# EasyEDA Pro project gps-v1.0.eprj

# Schematic Schematic1
Board Name: Board1; Create Date: 2025-04-23; Page Name: P1; Project Name: gps-v1.0; Schematic Name: Schematic1; Update Date: 2025-04-29; Company: EasyEDA.com; Page Size: A4; Version: V1.0
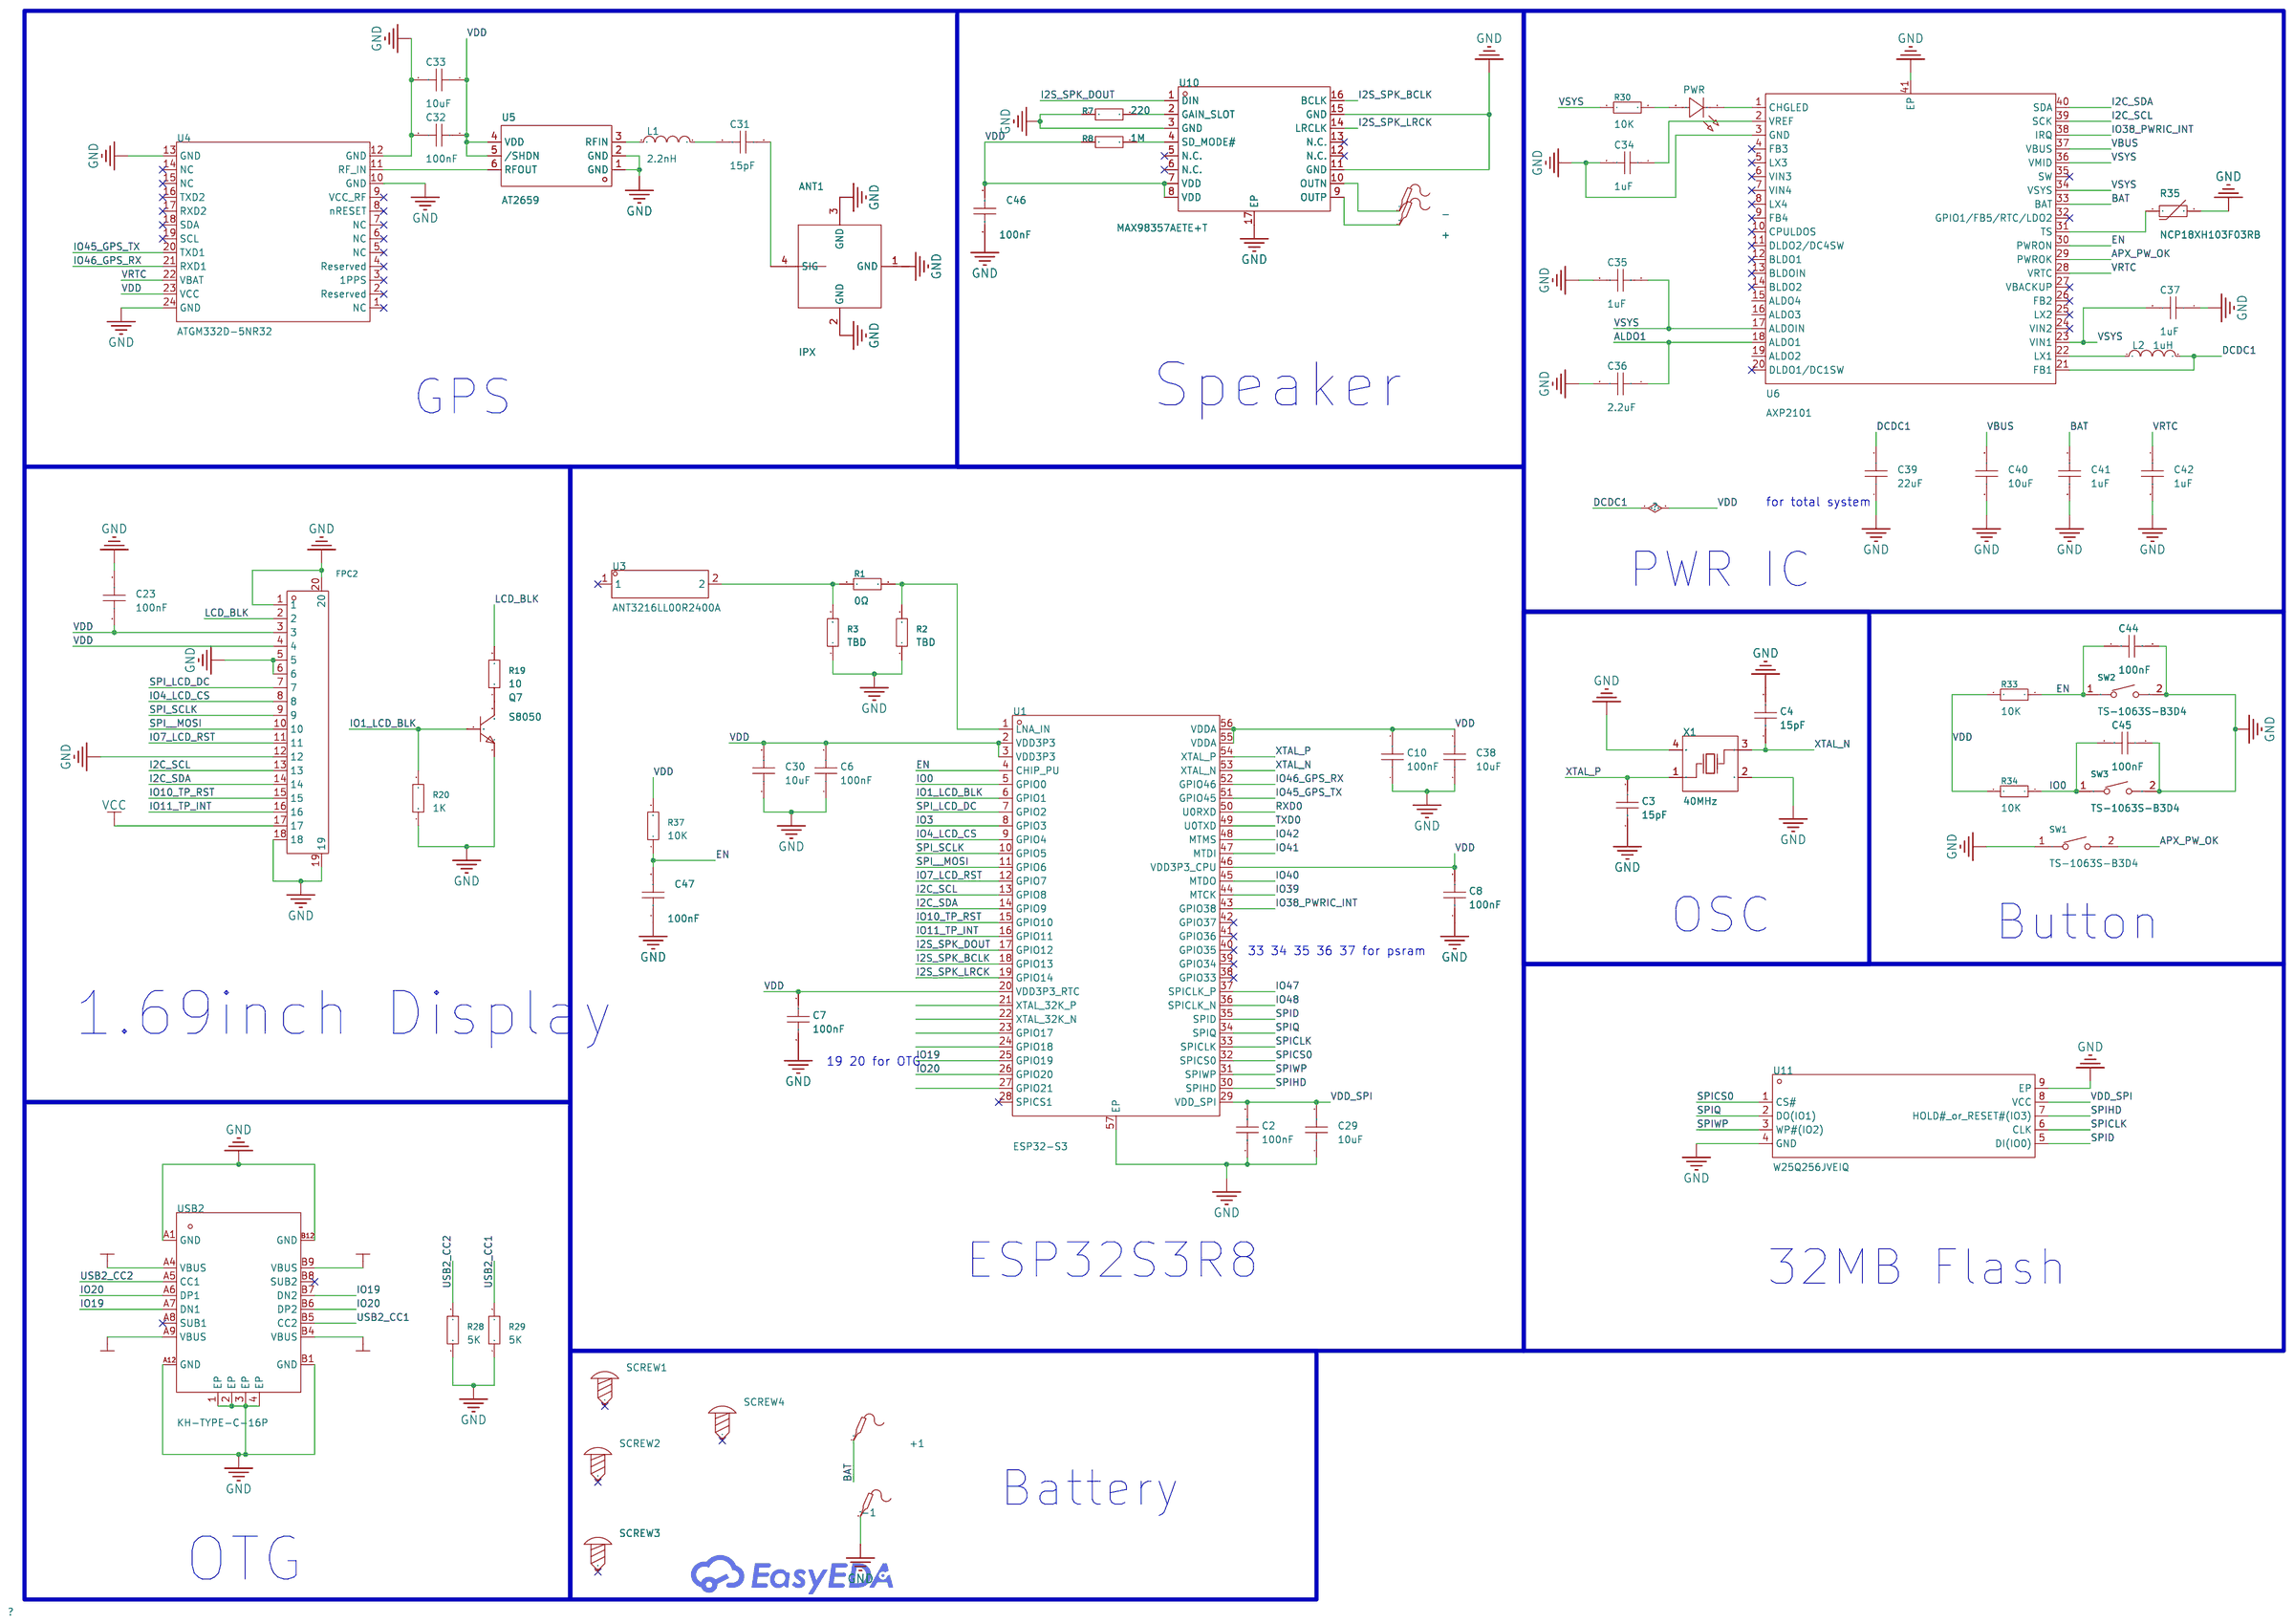
[diagram p0: schematic sheet]

## Parts
+  -  [Test-Point-0.5mm]
+1  -  [Test-Point-0.5mm]
-  -  [Test-Point-0.5mm]
-1  -  [Test-Point-0.5mm]
ANT1  IPX  [ANT-SMD_KH-IPEX-K501-29]
C2  100nF  [C0402]
C3  15pF  [C0402]
C4  15pF  [C0402]
C6  100nF  [C0402]
C7  100nF  [C0402]
C8  100nF  [C0402]
C10  100nF  [C0402]
C23  100nF  [C0402]
C29  10uF  [C0603]
C30  10uF  [C0603]
C31  15pF  [C0402]
C32  100nF  [C0402]
C33  10uF  [C0603]
C34  1uF  [C0402]
C35  1uF  [C0402]
C36  2.2uF  [C0402]
C37  1uF  [C0402]
C38  10uF  [C0603]
C39  22uF  [C0603]
C40  10uF  [C0603]
C41  1uF  [C0402]
C42  1uF  [C0402]
C44  100nF  [C0402]
C45  100nF  [C0402]
C46  100nF  [C0402]
C47  100nF  [C0402]
FPC2  FPC-05F-18PH20  [FPC-SMD_18P-P0.50_FPC-05F-18PH20]
L1  2.2nH  [L0603]
L2  1uH  [L0603]
PWR  XL-1608SURC-06  [LED0603-RD_RED]
Q7  S8050  [SOT-23-3_L2.9-W1.3-P1.90-LS2.3-BR]
R1  0Ω  [R0402]
R2  TBD  [R0402]
R3  TBD  [R0402]
R7  220  [R0402]
R8  1M  [R0402]
R19  10  [R0402]
R20  1K  [R0402]
R28  5K  [R0402]
R29  5K  [R0402]
R30  10K  [R0402]
R33  10K  [R0402]
R34  10K  [R0402]
R35  NCP18XH103F03RB  [R0603]
R37  10K  [R0402]
SCREW1  -  [Screw-Hole-M2]
SCREW2  -  [Screw-Hole-M2]
SCREW3  -  [Screw-Hole-M2]
SCREW4  -  [Screw-Hole-M2]
SW1  TS-1063S-B3D4  [KEY-SMD_L3.0-W2.5-LS4.0_TS-1603S]
SW2  TS-1063S-B3D4  [KEY-SMD_L3.0-W2.5-LS4.0_TS-1603S]
SW3  TS-1063S-B3D4  [KEY-SMD_L3.0-W2.5-LS4.0_TS-1603S]
U1  ESP32-S3  [QFN-56_L7.0-W7.0-P0.40-TL-EP4.0]
U3  ANT3216LL00R2400A  [ANT-SMD_L3.2-W1.6]
U4  ATGM332D-5NR32  [GSM-SMD_ATGM332D-5N11]
U5  AT2659  [DFN-6_L1.6-W1.0-P0.55-BL]
U6  AXP2101  [QFN-40_L5.0-W5.0-P0.40-TL-EP3.4]
U10  MAX98357AETE+T  [TQFN-16_L3.0-W3.0-P0.50-BL-EP1.5]
U11  W25Q256JVEIQ  [WSON-8_L8.0-W6.10-P1.27-BL-EP]
USB2  KH-TYPE-C-16P  [USB-C-SMD_KH-TYPE-C-16P]
X1  40MHz  [OSC-SMD_4P-L3.2-W2.5-BL_SIT8008BI]

## Library data of the parts
+ +1 - -1 = Test-Point
ANT1 = IPX: Supplier Part: C9900014785; Supplier Footprint: GSM_ANT; JLCPCB Part Class: Extended Part; Supplier: LCSC
C2-C4 C6-C8 C10 C31 C32 C34-C37 C41 C42 C44 C45 = CL05A105KA5NQNC: Capacitance: Tolerance:±10% Tolerance:±10% Voltage Rated: Temperature Coefficient:; LCSC Part Name: 1uF ±10% 25V; Supplier Part: C52923; Manufacturer: SAMSUNG(三星); Supplier Footprint: 0402; JLCPCB Part Class: Basic Part; Datasheet: https://atta.szlcsc.com/upload/public/pdf/source/20160218/1457707763339.pdf; Supplier: LCSC; Tolerance: ±10%
C23 C46 C47 = CL05B104KO5NNNC: Capacitance: Tolerance:±10% Tolerance:±10% Voltage Rated: Temperature Coefficient:; LCSC Part Name: 100nF ±10% 16V; Supplier Part: C1525; Manufacturer: SAMSUNG(三星); Supplier Footprint: 0402; JLCPCB Part Class: Basic Part; Datasheet: https://atta.szlcsc.com/upload/public/pdf/source/20160218/1457707763339.pdf; Supplier: LCSC; Tolerance: ±10%
C29 C30 C33 C38-C40 = CGA0603X5R106K100JT: Capacitance:10uF Tolerance:±10% Tolerance:±10% Voltage Rating:10V Temperature Coefficient:X5R; LCSC Part Name: 10uF ±10% 10V; Supplier Part: C6119842; Manufacturer: HRE(芯声); Supplier Footprint: 0603; JLCPCB Part Class: Extended Part; Supplier: LCSC; Tolerance: ±10%; Voltage Rating: 10V; Temperature Coefficient: X5R
FPC2 = FPC-05F-18PH20: Locking Feature:Clamshell Contact Type:Bottom Contact Number of Contacts:18P Pitch:0.5mm Mounting Type:卧贴 FFC, FCB Thickness:0.3mm FFC, FCB Thickness:0.3mm Height Above Board:2mm Operating Temperature Range:-25℃~+85℃ Operating Temperature Range:-25℃~+85℃; LCSC Part Name: 间距:0.5mm P数:18P 翻盖式 下接; Supplier Part: C2856802; Manufacturer: XUNPU(讯普); Supplier Footprint: SMD,P=0.5mm,卧贴; JLCPCB Part Class: Extended Part; Datasheet: https://atta.szlcsc.com/upload/public/pdf/source/20210922/C2856802_2A845D1961F33AEC1ED22CECB292335F.pdf; Supplier: LCSC; Locking Feature: Clamshell; Contact Type: Bottom Contact; Number of Contacts: 18P; Pitch: 0.5mm; Mounting Type: 卧贴; FFC, FCB Thickness: 0.3mm; Height Above Board: 2mm; Operating Temperature Range: -25℃~+85℃
L1 L2 = LQM18FN100M00D: LCSC Part Name: 10uH ±20% 50mA 停产; Supplier Part: C86083; Manufacturer: muRata(村田); Supplier Footprint: 0603; JLCPCB Part Class: Extended Part; Datasheet: https://atta.szlcsc.com/upload/public/pdf/source/20181211/C324471_E5AB673E56FAD8B75EB4C57DC23E4148.pdf; Supplier: LCSC; Tolerance: ±20%; Current Rating: 50mA; Current - Saturation (Isat): 50mA; DC Resistance(DCR): 1.17Ω; Frequency - Self Resonant: 30MHz
PWR = XL-1608SURC-06: Lamp Holder Type:- Illumination Color:Red Voltage - Forward(Vf):2.3V Voltage - Forward(Vf):2.3V Power(Watts):50mW Forward Current:20mA Wavelength - Dominant:620nm~630nm Wavelength - Dominant:620nm~630nm Peak Wavelength:625nm Diode Configuration:- Lens Col; Supplier Part: C965799; Manufacturer: XINGLIGHT(成兴光); Supplier Footprint: 0603; JLCPCB Part Class: Extended Part; Datasheet: https://atta.szlcsc.com/upload/public/pdf/source/20250213/F9766CE804AF391355DCDD48DB3E0DAB.pdf; Supplier: LCSC; Illumination Color: Red; Voltage - Forward(Vf): 2.3V; Power(Watts): 50mW; Forward Current: 20mA; Wavelength - Dominant: 620nm~630nm; Peak Wavelength: 625nm; Lens Color: Colorless Transparent Lens; Luminous Intensity: 225mcd; Viewing Angle: 120°; Mounting Sytle: Positive Stick; Operating Temperature: -20℃~+85℃
Q7 = S8050_C20069125: type:NPN Current - Collector(Ic): Collector - Emitter Voltage VCEO: Pd - Power Dissipation:300mW DC Current Gain:120@50mA,1.0V DC Current Gain:120@50mA,1.0V Transition frequency(fT):100MHz Current - Collector Cutoff:100nA Vce Saturation(VCE(sat)):600mV Op; LCSC Part Name: hFE:200-350，丝印:J3Y S8050; Supplier Part: C20069125; Manufacturer: 宏嘉诚; Supplier Footprint: SOT-23; JLCPCB Part Class: Extended Part; Datasheet: https://atta.szlcsc.com/upload/public/pdf/source/20250107/343E8B94B5C24D0D65D7D4B70E0B73F6.pdf; Supplier: LCSC; type: NPN; Pd - Power Dissipation: 300mW; DC Current Gain: 120@50mA,1.0V; Transition frequency(fT): 100MHz; Current - Collector Cutoff: 100nA; Vce Saturation(VCE(sat)): 600mV; Operating Temperature: -55℃~+150℃
R1-R3 R30 = 0402WGF0000TCE: Type:Thick Film Resistors Resistance: Tolerance:±1% Tolerance:±1% Power(Watts): Overload Voltage (Max): Temperature Coefficient:±800ppm/℃ Temperature Coefficient:±800ppm/℃ Operating Temperature Range:-55℃~+155℃ Operating Temperature Range:-55℃~+155℃; LCSC Part Name: 0Ω ±1% 62.5mW 厚膜电阻; Supplier Part: C17168; Manufacturer: UNI-ROYAL(厚声); Supplier Footprint: 0402; JLCPCB Part Class: Basic Part; Datasheet: https://atta.szlcsc.com/upload/public/pdf/source/20200306/C422600_1E6D84923E4A46A82E41ADD87F860B5C.pdf; Supplier: LCSC; Type: Thick Film Resistors; Tolerance: ±1%; Temperature Coefficient: ±800ppm/℃; Operating Temperature Range: -55℃~+155℃
R7 R8 R19 R20 R28 R29 R33 R34 R37 = 0402WGF4700TCE: Type:Thick Film Resistors Resistance: Tolerance:±1% Tolerance:±1% Power(Watts): Overload Voltage (Max): Temperature Coefficient:±100ppm/℃ Temperature Coefficient:±100ppm/℃ Operating Temperature Range:-55℃~+155℃ Operating Temperature Range:-55℃~+155℃; LCSC Part Name: 470Ω ±1% 62.5mW 厚膜电阻; Supplier Part: C25117; Manufacturer: UNI-ROYAL(厚声); Supplier Footprint: 0402; JLCPCB Part Class: Basic Part; Datasheet: https://atta.szlcsc.com/upload/public/pdf/source/20200306/C422600_1E6D84923E4A46A82E41ADD87F860B5C.pdf; Supplier: LCSC; Type: Thick Film Resistors; Tolerance: ±1%; Temperature Coefficient: ±100ppm/℃; Operating Temperature Range: -55℃~+155℃
R35 = NCP18XH103F03RB: LCSC Part Name: 10kΩ 电阻精度:±1% 3380K; Supplier Part: C13564; Manufacturer: muRata(村田); Supplier Footprint: 0603; Datasheet: https://atta.szlcsc.com/upload/public/pdf/source/20130819/1457706638081.pdf; Supplier: LCSC; B Constant (25℃/85℃): 3434K; B Constant (25℃/100℃): 3455K; Steady State Current (Max): 310uA; Operating Temperature: -40℃~+125℃
SCREW1-SCREW4 = Screw-Hole-M2: Supplier Footprint: 插件
SW1-SW3 = TS-1063S-B3D4: LCSC Part Name: 轻触开关3.0*2.5侧按贴片带柱小小龟250gf; Supplier Part: C498291; Manufacturer: Yuandi(元迪); JLCPCB Part Class: Extended Part; Datasheet: https://atta.szlcsc.com/upload/public/pdf/source/20200318/C498291_A3607BD92317BA61A63F6AFAF35A0DD0.pdf; Supplier: LCSC; Circuit: SPST; Actuator Style: Rectangle button; Operating Force: 250gf
U1 = ESP32-S3: Frequency Range:2412MHz~2484MHz Frequency Range:2412MHz~2484MHz Interface:ADC,GPIO,I2C,I2S,PWM,SPI,UART,USB Operating Voltage:3V~3.6V Operating Voltage:3V~3.6V Applications:WiFi；IoT Output Power:21dBm Data Rate:150Mbps Current Of Transmitting:340mA Sensit; LCSC Part Name: 支持2.4GHz WIFI和低功耗蓝牙的MCU SoC; Supplier Part: C2913192; Manufacturer: ESPRESSIF(乐鑫); Supplier Footprint: QFN-56-EP(7x7); JLCPCB Part Class: Extended Part; Datasheet: https://atta.szlcsc.com/upload/public/pdf/source/20241030/3428D9BCA56E860957850BFAF37EAC62.pdf; Supplier: LCSC; Frequency Range: 2412MHz~2484MHz; Interface: ADC,GPIO,I2C,I2S,PWM,SPI,UART,USB; Operating Voltage: 3V~3.6V; Applications: WiFi；IoT; Output Power: 21dBm; Data Rate: 150Mbps; Current Of Transmitting: 340mA; Sensitivity: -98.4dBm; Receive Current: 88mA; Typical Application Frequency: 2.4GHz; Operating Temperature: -40℃~+105℃
U3 = ANT3216LL00R2400A: Antenna Type:Chip Antenna Central Frequency:2450MHz Bandwidth:160MHz Peak Gain:5.05dBi Peak Gain:5.05dBi Polarization Type:Linear Impedance:50Ω Power capacity:1W VSWR:- Operating Temperature:-40℃~+105℃ Operating Temperature:-40℃~+105℃; LCSC Part Name: 无线组件陶瓷芯片天线; Supplier Part: C293767; Manufacturer: YAGEO(国巨); Supplier Footprint: 1206; JLCPCB Part Class: Extended Part; Datasheet: https://atta.szlcsc.com/upload/public/pdf/source/20181012/C293767_CDE82A2F74DC82A94DB708CB53B68F23.pdf; Supplier: LCSC; Antenna Type: Chip Antenna; Central Frequency: 2450MHz; Bandwidth: 160MHz; Peak Gain: 5.05dBi; Polarization Type: Linear; Impedance: 50Ω; Power capacity: 1W; Operating Temperature: -40℃~+105℃
U4 = ATGM332D-5NR32: LCSC Part Name: BDS/GNSS 全星座定位导航模块; Supplier Part: C3037611; Manufacturer: 杭州中科微; JLCPCB Part Class: Extended Part; Datasheet: https://atta.szlcsc.com/upload/public/pdf/source/20220623/89B350A4689FD8DAA801C638D9ED4BB8.pdf; Supplier: LCSC
U5 = AT2659: LCSC Part Name: L1频段卫星导航射频前端低噪声放大器芯片; Supplier Part: C92450; Manufacturer: 杭州中科微; Supplier Footprint: DFN-6(1x1.6); JLCPCB Part Class: Extended Part; Datasheet: https://atta.szlcsc.com/upload/public/pdf/source/20170105/1483610792788.pdf; Supplier: LCSC; Supply Voltage: 1.4V~3.6V; Gain: 21.5dB; P1dB: -14dBm; Noise Figure: 0.8dB
U6 = AXP2101: Supplier Part: C3036461; Manufacturer: x-powers; Supplier Footprint: QFN-40-EP(5x5); JLCPCB Part Class: Extended Part; Datasheet: https://atta.szlcsc.com/upload/public/pdf/source/20230506/27D868F447993329A9E953603DF31964.pdf; Supplier: LCSC
U10 = MAX98357AETE+T: Type of Power Amplifier: Speaker Channels:Monaural Output Power: Supply Voltage:2.5V~5.5V Supply Voltage:2.5V~5.5V Operating Temperature:-40℃~+85℃ Operating Temperature:-40℃~+85℃; LCSC Part Name: 微型、低成本、PCM 类 D 级放大器具有 AB 级性能; Supplier Part: C910544; Manufacturer: ADI(亚德诺)/MAXIM(美信); Supplier Footprint: TQFN-16-EP(3x3); JLCPCB Part Class: Extended Part; Datasheet: https://atta.szlcsc.com/upload/public/pdf/source/20210106/C910544_CB6DE4B2CEE254A72E6BDB40E718D281.pdf; Supplier: LCSC; Speaker Channels: Monaural; Supply Voltage: 2.5V~5.5V; Operating Temperature: -40℃~+85℃
U11 = W25Q256JVEIQ_C97522: Supplier Part: C97522; Manufacturer: WINBOND(华邦); Supplier Footprint: WSON-8-EP(6x8); JLCPCB Part Class: Extended Part; Datasheet: https://atta.szlcsc.com/upload/public/pdf/source/20190529/C97522_47AE152D0BB11FB4C8509E398C0AD2EA.pdf; Supplier: LCSC; Interface Type: SPI; Memory Size: 256Mbit; Clock Frequency (fc): 133MHz; Supply Voltage: 2.7V~3.6V; Page Programming Time (Tpp): 700us; Block Erase Time (tBE): 120ms@(32KB); Data Retention - TDR (Year): 20 years; Operating Temperature: -40℃~+85℃
USB2 = KH-TYPE-C-16P: Connector Type:Type-C Standard:- Gender:Female Number of Ports:1 Number of Contacts:16P Mounting Style:卧贴 Current Rating - Power (Max):3A Operating Temperature Range:-40℃~+85℃ Operating Temperature Range:-40℃~+85℃; LCSC Part Name: Type-C 母 卧贴; Supplier Part: C709357; Manufacturer: kinghelm(金航标); Supplier Footprint: SMD; JLCPCB Part Class: Extended Part; Datasheet: https://atta.szlcsc.com/upload/public/pdf/source/20200911/C709357_AA8DCEB38BB20E3035A7ED7AE7667837.pdf; Supplier: LCSC; Connector Type: Type-C; Gender: Female; Number of Ports: 1; Number of Contacts: 16P; Mounting Style: 卧贴; Current Rating - Power (Max): 3A; Operating Temperature Range: -40℃~+85℃
X1 = X322540MPB4SI: Crystal Type:Surface Mount Crystal Frequency: Normal temperature Frequency Tolerance:±10ppm Normal temperature Frequency Tolerance:±10ppm External load capacitor: Frequency Stability(Full temperature range):±20ppm Frequency Stability(Full temperature rang; LCSC Part Name: 40MHz ±10ppm 15pF; Supplier Part: C9010; Manufacturer: YXC(扬兴晶振); Supplier Footprint: SMD3225-4P; JLCPCB Part Class: Extended Part; Datasheet: https://atta.szlcsc.com/upload/public/pdf/source/20240329/19D5F850207469550BEB00D7DFEDBC7A.pdf; Supplier: LCSC; Crystal Type: Surface Mount Crystal; Normal temperature Frequency Tolerance: ±10ppm; Frequency Stability(Full temperature range): ±20ppm

## Nets
GND: -1.1 ANT1.1(GND) ANT1.2(GND) ANT1.3(GND) C2.1 C3.1 C4.2 C6.1 C7.1 C8.1 C10.1 C23.1 C29.1 C30.1 C32.2 C33.2 C34.2 C35.2 C36.2 C37.1 C38.1 C39.1 C40.1 C41.2 C42.2 C44.2 C45.1 C46.1 C47.1 FPC2.1 FPC2.5 FPC2.6 FPC2.12 FPC2.18 FPC2.19 FPC2.20 Q7.2(E) R2.1 R3.1 R7.2 R20.1 R28.1 R29.1 R35.2 SW1.1 SW2.2 SW3.2 U1.57(EP) U4.10(GND) U4.12(GND) U4.13(GND) U4.24(GND) U5.1(GND) U5.2(GND) U6.3(GND) U6.41(EP) U10.3(GND) U10.11(GND) U10.15(GND) U10.17(EP) U11.4(GND) U11.9(EP) USB2.1(EP) USB2.2(EP) USB2.3(EP) USB2.4(EP) USB2.A1(GND) USB2.A12(GND) USB2.B1(GND) USB2.B12(GND) X1.2(GND) X1.4(GND)
VBUS: C40.2 U6.37(VBUS) USB2.A4(VBUS) USB2.A9(VBUS) USB2.B4(VBUS) USB2.B9(VBUS)
VCC: FPC2.17
VDD_SPI: C2.2 C29.2 U1.29(VDD_SPI) U11.8(VCC)
ALDO1: C36.1 U6.18(ALDO1)
APX_PW_OK: SW1.2 U6.29(PWROK)
BAT: +1.1 C41.1 U6.33(BAT)
DCDC1: C6.2 C7.2 C8.2 C10.2 C23.2 C30.2 C32.1 C33.1 C38.2 C39.2 C46.2 FPC2.3 FPC2.4 L2.2 R8.2 R33.2 R34.2 R37.2 U1.2(VDD3P3) U1.3(VDD3P3) U1.20(VDD3P3_RTC) U1.46(VDD3P3_CPU) U1.55(VDDA) U1.56(VDDA) U4.23(VCC) U5.4(VDD) U5.5(/SHDN) U6.21(FB1) U10.7(VDD) U10.8(VDD)
EN: C44.1 C47.2 R33.1 R37.1 SW2.1 U1.4(CHIP_PU) U6.30(PWRON)
I2C_SCL: FPC2.13 U1.13(GPIO8) U6.39(SCK)
I2C_SDA: FPC2.14 U1.14(GPIO9) U6.40(SDA)
I2S_SPK_BCLK: U1.18(GPIO13) U10.16(BCLK)
I2S_SPK_DOUT: U1.17(GPIO12) U10.1(DIN)
I2S_SPK_LRCK: U1.19(GPIO14) U10.14(LRCLK)
IO0: C45.2 R34.1 SW3.1 U1.5(GPIO0)
IO1_LCD_BLK: Q7.1(B) R20.2 U1.6(GPIO1)
IO3: U1.8(GPIO3)
IO4_LCD_CS: FPC2.8 U1.9(GPIO4)
IO7_LCD_RST: FPC2.11 U1.12(GPIO7)
IO10_TP_RST: FPC2.15 U1.15(GPIO10)
IO11_TP_INT: FPC2.16 U1.16(GPIO11)
IO19: U1.25(GPIO19) USB2.A7(DN1) USB2.B7(DN2)
IO20: U1.26(GPIO20) USB2.A6(DP1) USB2.B6(DP2)
IO38_PWRIC_INT: U1.43(GPIO38) U6.38(IRQ)
IO39: U1.44(MTCK)
IO40: U1.45(MTDO)
IO41: U1.47(MTDI)
IO42: U1.48(MTMS)
IO45_GPS_TX: U1.51(GPIO45) U4.20(TXD1)
IO46_GPS_RX: U1.52(GPIO46) U4.21(RXD1)
IO47: U1.37(SPICLK_P)
IO48: U1.36(SPICLK_N)
LCD_BLK: FPC2.2 R19.2
RXD0: U1.50(U0RXD)
SPI__MOSI: FPC2.10 U1.11(GPIO6)
SPI_LCD_DC: FPC2.7 U1.7(GPIO2)
SPI_SCLK: FPC2.9 U1.10(GPIO5)
SPICLK: U1.33(SPICLK) U11.6(CLK)
SPICS0: U1.32(SPICS0) U11.1(CS#)
SPID: U1.35(SPID) U11.5(DI(IO0))
SPIHD: U1.30(SPIHD) U11.7(HOLD# or RESET#(IO3))
SPIQ: U1.34(SPIQ) U11.2(DO(IO1))
SPIWP: U1.31(SPIWP) U11.3(WP#(IO2))
TXD0: U1.49(U0TXD)
USB2_CC1: R29.2 USB2.B5(CC2)
USB2_CC2: R28.2 USB2.A5(CC1)
VRTC: C42.1 U4.22(VBAT) U6.28(VRTC)
VSYS: C35.1 C37.2 R30.1 U6.17(ALDOIN) U6.23(VIN1) U6.34(VSYS) U6.36(VMID)
XTAL_N: C4.1 U1.53(XTAL_N) X1.3(OSC2)
XTAL_P: C3.2 U1.54(XTAL_P) X1.1(OSC1)
$1N925: R1.2 R2.2 U1.1(LNA_IN)
$1N926: R1.1 R3.2 U3.2
$1N2038: C31.2 L1.2
$1N2043: ANT1.4(SIG) C31.1
$1N2047: L1.1 U5.3(RFIN)
$1N2051: U4.11(RF_IN) U5.6(RFOUT)
$1N2534: PWR.2(A) R30.2
$1N2538: PWR.1(K) U6.1(CHGLED)
$1N2588: C34.1 U6.2(VREF)
$1N2848: L2.1 U6.22(LX1)
$1N4213: Q7.3(C) R19.1
$1N5891: R7.1 U10.2(GAIN_SLOT)
$1N5893: R8.1 U10.4(SD_MODE#)
$1N5897: -.1 U10.10(OUTN)
$1N5898: +.1 U10.9(OUTP)
$1N8095: R35.1 U6.31(TS)

Not connected (* = marked no-connect by the designer): SCREW1 1*; SCREW2 1*; SCREW3 1*; SCREW4 1*; U1 21(XTAL_32K_P) 22(XTAL_32K_N) 23(GPIO17) 24(GPIO18) 27(GPIO21) 28(SPICS1)* 38(GPIO33)* 39(GPIO34)* 40(GPIO35)* 41(GPIO36)* 42(GPIO37)*; U3 1*; U4 1(NC)* 2(Reserved)* 3(1PPS)* 4(Reserved)* 5(NC)* 6(NC)* 7(NC)* 8(nRESET)* 9(VCC_RF)* 14(NC)* 15(NC)* 16(TXD2)* 17(RXD2)* 18(SDA)* 19(SCL)*; U6 4(FB3)* 5(LX3)* 6(VIN3)* 7(VIN4)* 8(LX4)* 9(FB4)* 10(CPULDOS)* 11(DLDO2/DC4SW)* 12(BLDO1)* 13(BLDOIN)* 14(BLDO2)* 15(ALDO4) 16(ALDO3) 19(ALDO2) 20(DLDO1/DC1SW)* 24(VIN2)* 25(LX2)* 26(FB2)* 27(VBACKUP)* 32(GPIO1/FB5/RTC/LDO2)* 35(SW)*; U10 5(N.C.)* 6(N.C.)* 12(N.C.)* 13(N.C.)*; USB2 A8(SUB1)* B8(SUB2)*

## Notes on the sheet
- GPS
- Speaker
- for total system
- PWR IC
- OSC
- Button
- 33 34 35 36 37 for psram
- 1.69inch Display
- 19 20 for OTG
- ESP32S3R8
- 32MB Flash
- Battery
- OTG

# Board PCB1
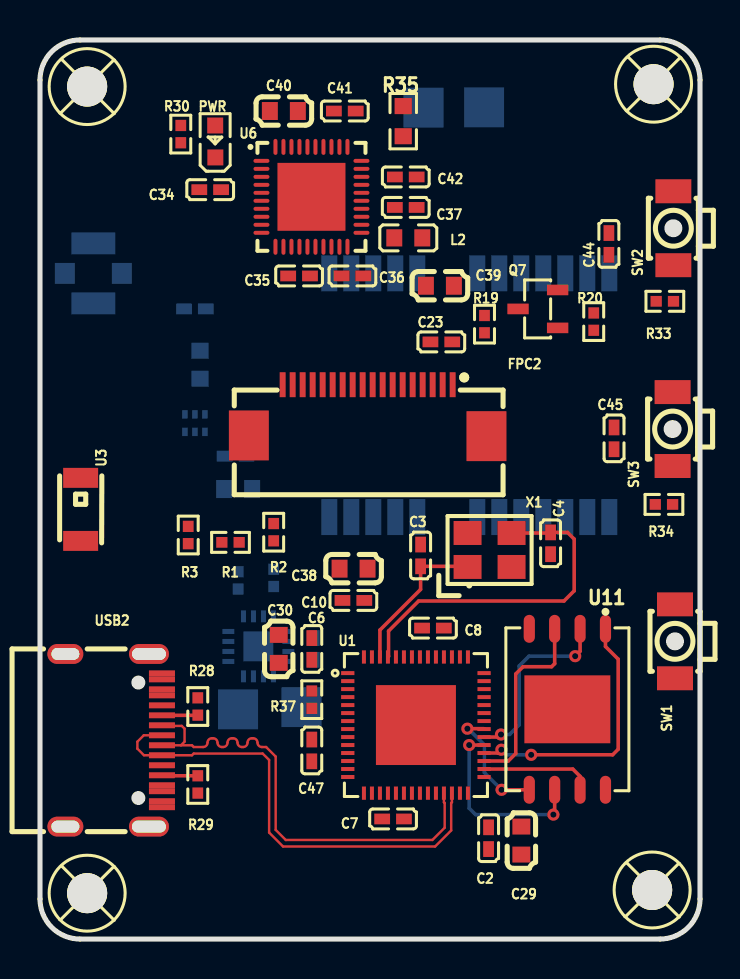
[diagram p1: board, top side]
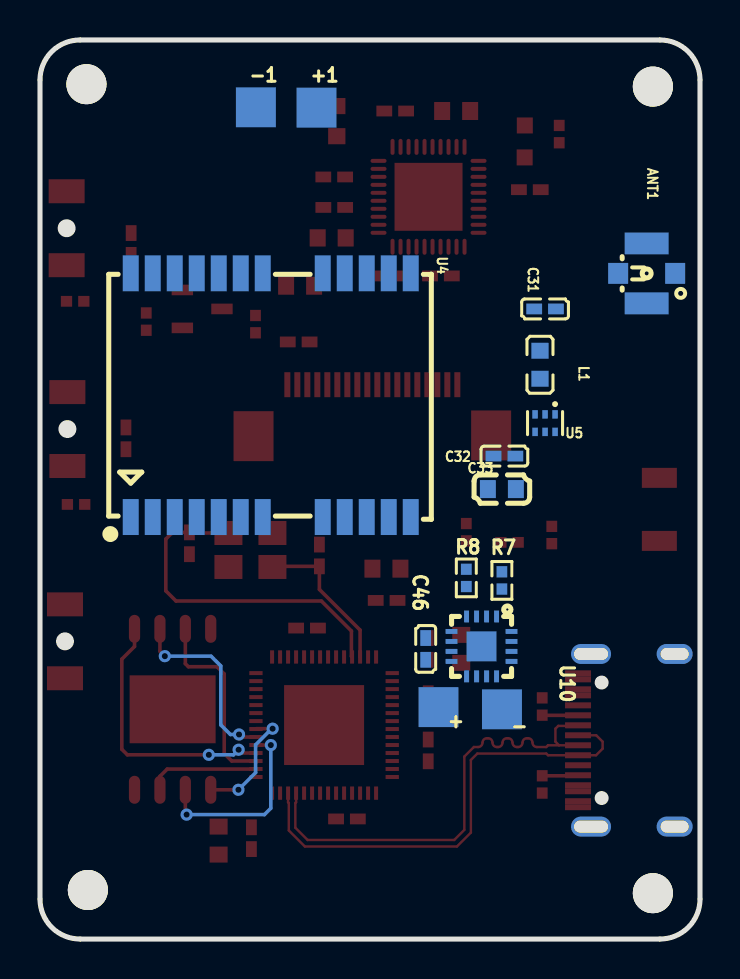
[diagram p2: board, bottom side, seen from below]

Outline 33 x 45 mm; copper layers: Top Layer, Bottom Layer. Coordinates in mm from the lower left corner of the outline.
Outline path: 0,43 0,2 arc(0.59,0.59) 2,0 31,0 arc(32.41,0.59) 33,2 33,43 arc(32.41,44.41) 31,45 2,45 arc(0.59,44.41) 0,43
Stack: Top Layer 0.035mm / Dielectric1 1.51mm FR4 er 4.5 / Bottom Layer 0.035mm

## Design rules (mm)
net IO19: DP1
net IO20: DP1
template: Custom Config
spacing copperThickness1oz (default): track to track 0.102, other pairs 0.152 to 0.3
spacing copperThickness2oz: track to track 0.203, other pairs 0.152 to 0.3
track width copperThickness1oz (default): min 0.127, default 0.18, max 2.54
track width copperThickness2oz: min 0.203, default 0.254, max 2.54
differential pair differentialPair (default): width min 0.124, default 0.124, max 0.124; gap min 0.203, default 0.203
via viaSize (default): diameter min 0.5, default 0.61, max 10; hole min 0.3, default 0.305, max 6.3

## Placement (name value [footprint] x y rotation side)
+  -  [Test-Point-0.5mm]  13.08 11.61 0 bottom
+1  -  [Test-Point-0.5mm]  19.17 41.61 180 bottom
-  -  [Test-Point-0.5mm]  9.9 11.5 0 bottom
-1  -  [Test-Point-0.5mm]  22.2 41.63 180 bottom
ANT1  IPX  [ANT-SMD_KH-IPEX-K501-29]  2.67 33.32 90 bottom
C2  100nF  [C0402]  22.43 5.05 90 top
C3  15pF  [C0402]  19.03 19.2 270 top
C4  15pF  [C0402]  25.53 19.81 270 top
C6  100nF  [C0402]  13.59 14.52 270 top
C7  100nF  [C0402]  17.65 6.01 0 top
C8  100nF  [C0402]  19.65 15.56 0 top
C10  100nF  [C0402]  15.67 16.95 0 top
C23  100nF  [C0402]  20.07 29.89 0 top
C29  10uF  [C0603]  24.07 4.93 90 top
C30  10uF  [C0603]  11.94 14.52 270 top
C31  15pF  [C0402]  7.75 31.54 0 bottom
C32  100nF  [C0402]  9.78 24.17 0 bottom
C33  10uF  [C0603]  9.91 22.52 0 bottom
C34  1uF  [C0402]  8.51 37.51 180 top
C35  1uF  [C0402]  12.95 33.19 180 top
C36  2.2uF  [C0402]  15.62 33.19 0 top
C37  1uF  [C0402]  18.29 36.62 180 top
C38  10uF  [C0603]  15.68 18.54 0 top
C39  22uF  [C0603]  19.99 32.7 180 top
C40  10uF  [C0603]  12.19 41.44 0 top
C41  1uF  [C0402]  15.24 41.44 0 top
C42  1uF  [C0402]  18.29 38.14 0 top
C44  100nF  [C0402]  28.44 34.79 90 top
C45  100nF  [C0402]  28.7 25.06 270 top
C46  100nF  [C0402]  13.72 14.52 270 bottom
C47  100nF  [C0402]  13.59 9.44 90 top
FPC2  FPC-05F-18PH20  [FPC-SMD_18P-P0.50_FPC-05F-18PH20]  16.38 26.46 0 top
L1  2.2nH  [L0603]  8 28.74 90 bottom
L2  1uH  [L0603]  18.41 35.09 0 top
PWR  XL-1608SURC-06  [LED0603-RD_RED]  8.76 39.92 90 top
Q7  S8050  [SOT-23-3_L2.9-W1.3-P1.90-LS2.3-BR]  24.89 31.54 0 top
R1  0Ω  [R0402]  9.52 19.85 0 top
R2  TBD  [R0402]  11.68 20.36 270 top
R3  TBD  [R0402]  7.41 20.22 270 top
R7  220  [R0402]  9.91 17.95 90 bottom
R8  1M  [R0402]  11.68 18.08 90 bottom
R19  10  [R0402]  22.22 30.78 270 top
R20  1K  [R0402]  27.69 30.9 270 top
R28  5K  [R0402]  7.89 11.64 270 top
R29  5K  [R0402]  7.89 7.74 90 top
R30  10K  [R0402]  7.04 40.29 90 top
R33  10K  [R0402]  31.24 31.92 180 top
R34  10K  [R0402]  31.2 21.75 180 top
R35  NCP18XH103F03RB  [R0603]  18.16 40.94 90 top
R37  10K  [R0402]  13.59 11.98 90 top
SCREW1  -  [Screw-Hole-M2]  2.36 2.29 0 top
SCREW2  -  [Screw-Hole-M2]  2.36 42.67 0 top
SCREW3  -  [Screw-Hole-M2]  30.68 42.79 0 top
SCREW4  -  [Screw-Hole-M2]  30.61 2.45 0 top
SW1  TS-1063S-B3D4  [KEY-SMD_L3.0-W2.5-LS4.0_TS-1603S]  31.75 14.9 90 top
SW2  TS-1063S-B3D4  [KEY-SMD_L3.0-W2.5-LS4.0_TS-1603S]  31.67 35.58 90 top
SW3  TS-1063S-B3D4  [KEY-SMD_L3.0-W2.5-LS4.0_TS-1603S]  31.63 25.53 90 top
U1  ESP32-S3  [QFN-56_L7.0-W7.0-P0.40-TL-EP4.0]  18.8 10.71 0 top
U3  ANT3216LL00R2400A  [ANT-SMD_L3.2-W1.6]  2.03 21.5 270 top
U4  ATGM332D-5NR32  [GSM-SMD_ATGM332D-5N11]  21.46 27.22 270 bottom
U5  AT2659  [DFN-6_L1.6-W1.0-P0.55-BL]  7.75 25.82 0 bottom
U6  AXP2101  [QFN-40_L5.0-W5.0-P0.40-TL-EP3.4]  13.57 37.15 0 top
U10  MAX98357AETE+T  [TQFN-16_L3.0-W3.0-P0.50-BL-EP1.5]  10.92 14.65 0 bottom
U11  W25Q256JVEIQ  [WSON-8_L8.0-W6.10-P1.27-BL-EP]  26.37 11.5 180 top
USB2  KH-TYPE-C-16P  [USB-C-SMD_KH-TYPE-C-16P]  3.68 9.95 270 top
X1  40MHz  [OSC-SMD_4P-L3.2-W2.5-BL_SIT8008BI]  22.48 19.47 0 top

## Footprints (pads in the part's own frame, mm; a bottom-side part is the same pattern mirrored in y, then rotated)
ANT-SMD_KH-IPEX-K501-29
  rect 1.05x1 smd: 1(0,-1.425) 4(0,1.425)
  rect 1.1x2.2 smd: 2(-1.5,0) 3(1.5,0)
ANT-SMD_L3.2-W1.6
  rect 1x1.75 smd: 1(-1.578,0) 2(1.578,0)
C0402
  rect 0.79x0.54 smd: 1(-0.545,0) 2(0.545,0)
C0603
  rect 0.8x0.9 smd: 1(-0.7,0) 2(0.7,0)
DFN-6_L1.6-W1.0-P0.55-BL
  rect 0.28x0.425 smd: 1(-0.5,-0.438) 2(0,-0.438) 3(0.5,-0.438) 4(0.5,0.438) 5(0,0.438) 6(-0.5,0.438)
FPC-SMD_18P-P0.50_FPC-05F-18PH20
  rect 0.3x1.25 smd: 1(4.25,1.288) 2(3.75,1.288) 3(3.25,1.288) 4(2.75,1.288) 5(2.25,1.288) 6(1.75,1.288) 7(1.25,1.288) 8(0.75,1.288) 9(0.25,1.288) 10(-0.25,1.288) 11(-0.75,1.288) 12(-1.25,1.288) 13(-1.75,1.288) 14(-2.25,1.288) 15(-2.75,1.288) 16(-3.25,1.288) 17(-3.75,1.288) 18(-4.25,1.288)
  rect 2x2.5 smd: 19(5.94,-1.288) 20(-5.94,-1.252)
GSM-SMD_ATGM332D-5N11
  rect 1.8x0.8 smd: 1(6.1,-7) 2(6.1,-5.9) 3(6.1,-4.8) 4(6.1,-3.7) 5(6.1,-2.6) 6(6.1,-1.5) 7(6.1,-0.4) 8(6.1,2.6) 9(6.1,3.7) 10(6.1,4.8) 11(6.1,5.9) 12(6.1,7) 13(-6.1,7) 14(-6.1,5.9) 15(-6.1,4.8) 16(-6.1,3.7) 17(-6.1,2.6) 18(-6.1,-0.4) 19(-6.1,-1.5) 20(-6.1,-2.6) 21(-6.1,-3.7) 22(-6.1,-4.8) 23(-6.1,-5.9) 24(-6.1,-7)
KEY-SMD_L3.0-W2.5-LS4.0_TS-1603S
  rect 1.2x1.8 smd: 1(-1.85,0) 2(1.85,0)
L0603
  rect 0.8x0.864 smd: 1(-0.7,0) 2(0.7,0)
LED0603-RD_RED
  rect 0.8x0.8 smd: 1(-0.799,-0.004) 2(0.799,0.004)
OSC-SMD_4P-L3.2-W2.5-BL_SIT8008BI
  rect 1.4x1.2 smd: 1(-1.1,-0.85) 2(1.1,-0.85) 3(1.1,0.85) 4(-1.1,0.85)
QFN-40_L5.0-W5.0-P0.40-TL-EP3.4
  oval 0.8x0.2 smd: 1(-2.5,1.8) 2(-2.5,1.4) 3(-2.5,1) 4(-2.5,0.6) 5(-2.5,0.2) 6(-2.5,-0.2) 7(-2.5,-0.6) 8(-2.5,-1) 9(-2.5,-1.4) 10(-2.5,-1.8) 21(2.5,-1.8) 22(2.5,-1.4) 23(2.5,-1) 24(2.5,-0.6) 25(2.5,-0.2) 26(2.5,0.2) 27(2.5,0.6) 28(2.5,1) 29(2.5,1.4) 30(2.5,1.8)
  oval 0.2x0.8 smd: 11(-1.8,-2.5) 12(-1.4,-2.5) 13(-1,-2.5) 14(-0.6,-2.5) 15(-0.2,-2.5) 16(0.2,-2.5) 17(0.6,-2.5) 18(1,-2.5) 19(1.4,-2.5) 20(1.8,-2.5) 31(1.8,2.5) 32(1.4,2.5) 33(1,2.5) 34(0.6,2.5) 35(0.2,2.5) 36(-0.2,2.5) 37(-0.6,2.5) 38(-1,2.5) 39(-1.4,2.5) 40(-1.8,2.5)
  rect 3.4x3.4 smd: 41(0,0)
QFN-56_L7.0-W7.0-P0.40-TL-EP4.0
  rect 0.665x0.2 smd: 1(-3.408,2.6) 2(-3.408,2.2) 3(-3.408,1.8) 4(-3.408,1.4) 5(-3.408,1) 6(-3.408,0.6) 7(-3.408,0.2) 8(-3.408,-0.2) 9(-3.408,-0.6) 10(-3.408,-1) 11(-3.408,-1.4) 12(-3.408,-1.8) 13(-3.408,-2.2) 14(-3.408,-2.6) 29(3.408,-2.6) 30(3.408,-2.2) 31(3.408,-1.8) 32(3.408,-1.4) 33(3.408,-1) 34(3.408,-0.6) 35(3.408,-0.2) 36(3.408,0.2) 37(3.408,0.6) 38(3.408,1) 39(3.408,1.4) 40(3.408,1.8) 41(3.408,2.2) 42(3.408,2.6)
  rect 0.2x0.665 smd: 15(-2.6,-3.408) 16(-2.2,-3.408) 17(-1.8,-3.408) 18(-1.4,-3.408) 19(-1,-3.408) 20(-0.6,-3.408) 21(-0.2,-3.408) 22(0.2,-3.408) 23(0.6,-3.408) 24(1,-3.408) 25(1.4,-3.408) 26(1.8,-3.408) 27(2.2,-3.408) 28(2.6,-3.408) 43(2.6,3.408) 44(2.2,3.408) 45(1.8,3.408) 46(1.4,3.408) 47(1,3.408) 48(0.6,3.408) 49(0.2,3.408) 50(-0.2,3.408) 51(-0.6,3.408) 52(-1,3.408) 53(-1.4,3.408) 54(-1.8,3.408) 55(-2.2,3.408) 56(-2.6,3.408)
  rect 4x4 smd: 57(0,0)
R0402
  rect 0.566x0.54 smd: 1(-0.433,0) 2(0.433,0)
R0603
  rect 0.806x0.864 smd: 1(-0.753,0) 2(0.753,0)
Screw-Hole-M2
  round 2 hole 2: 1(0,0)
SOT-23-3_L2.9-W1.3-P1.90-LS2.3-BR
  rect 1.07x0.532 smd: 1(0.99,-0.95) 2(0.99,0.95) 3(-0.99,0)
Test-Point-0.5mm
  rect 2x2 smd: 1(0,0)
TQFN-16_L3.0-W3.0-P0.50-BL-EP1.5
  rect 0.25x0.6 smd: 1(-0.749,-1.5) 2(-0.248,-1.5) 3(0.252,-1.5) 4(0.751,-1.5) 9(0.75,1.5) 10(0.25,1.5) 11(-0.25,1.5) 12(-0.749,1.5)
  rect 0.6x0.25 smd: 5(1.5,-0.748) 6(1.5,-0.248) 7(1.5,0.252) 8(1.5,0.752) 13(-1.5,0.752) 14(-1.5,0.252) 15(-1.5,-0.248) 16(-1.5,-0.748)
  rect 1.5x1.5 smd: 17(0,0)
USB-C-SMD_KH-TYPE-C-16P
  oval 1x2 hole 0.6x1.7: 1(-4.32,1.765) 2(4.32,1.765)
  oval 1x1.8 hole 0.6x1.4: 3(-4.32,-2.415) 4(4.32,-2.415)
  rect 0.3x1.3 smd: A1(-3.35,2.415) A4(-2.55,2.415) A5(-1.25,2.415) A6(-0.25,2.415) A7(0.25,2.415) A8(1.25,2.415) A9(2.55,2.415) A12(3.35,2.415) B1(3.05,2.415) B4(2.25,2.415) B5(1.75,2.415) B6(0.75,2.415) B7(-0.75,2.415) B8(-1.75,2.415) B9(-2.25,2.415) B12(-3.05,2.415)
WSON-8_L8.0-W6.10-P1.27-BL-EP
  oval 0.56x1.4 smd: 1(-1.905,-4.027) 2(-0.635,-4.027) 3(0.635,-4.027) 4(1.905,-4.027) 5(1.905,4.027) 6(0.635,4.027) 7(-0.635,4.027) 8(-1.905,4.027)
  rect 4.3x3.4 smd: 9(0,0)

## Nets
As in the schematic.

Pads without a net: SCREW1 1; SCREW2 1; SCREW3 1; SCREW4 1; U1 28 38 39 40 41 42; U3 1; U4 1 2 3 4 5 6 7 8 9 14 15 16 17 18 19; U6 4 5 6 7 8 9 10 11 12 13 14 15 16 19 20 24 25 26 27 32 35; U10 5 6 12 13; USB2 A8 B8

## Via types
v1: diameter 0.61, hole 0.305, Top Layer to Bottom Layer, 8 vias

## Routing (per net, layer and track width the routed paths; a pad name or vN(x,y) marks a point on that pad's centre or on a via; arc(x,y) is an arc through that point)
IO19: length 23.9
  Top Layer w0.124: USB2.B7 6.13,10.67 7.09,10.67 7.23,10.53 7.23,9.88 7.05,9.7 ; U1.25 20.2,6.85 20.23,6.81 20.23,5.57 19.62,4.96 12.29,4.96 11.78,5.46 11.78,9.13 11.31,9.61 11.09,9.61 arc(10.94,9.68) 10.88,9.83 arc(10.81,9.98) 10.66,10.05 10.59,10.05 arc(10.44,9.98) 10.38,9.83 arc(10.31,9.68) 10.16,9.61 10.09,9.61 arc(9.94,9.68) 9.88,9.83 arc(9.81,9.98) 9.66,10.05 9.59,10.05 arc(9.44,9.98) 9.38,9.83 arc(9.31,9.68) 9.16,9.61 9.09,9.61 arc(8.94,9.68) 8.88,9.83 arc(8.81,9.98) 8.66,10.05 8.59,10.05 arc(8.44,9.98) 8.38,9.83 arc(8.31,9.68) 8.16,9.61 7.69,9.61 7.6,9.7 7.05,9.7 ; 7.05,9.7 USB2.A7
IO20: length 23.8
  Top Layer w0.124: USB2.A6 5.19,10.2 4.87,9.88 4.87,9.53 5.2,9.2 USB2.B6 7.6,9.2 7.69,9.28 11.13,9.28 11.46,8.96 11.46,5.33 12.15,4.63 19.75,4.63 20.56,5.44 20.56,6.81 20.6,6.85 U1.26
SPICLK: length 9.5
  Top Layer w0.18: v1(21.46,9.71) 22.2,9.71 U1.33 ; v1(25.67,6.23) 25.73,6.29 25.73,7.47
  Bottom Layer w0.18: v1(21.46,9.71) 21.46,6.55 21.78,6.23 v1(25.67,6.23)
SPICS0: length 13.3
  Top Layer w0.18: v1(23.07,9.48) 22.9,9.31 U1.32 ; v1(24.56,9.22) 28.63,9.22 28.91,9.5 28.91,14.01 28.27,14.64 U11.1
  Bottom Layer w0.18: v1(24.56,9.22) 23.32,9.22 v1(23.07,9.48)
SPID: length 6
  Top Layer w0.18: v1(21.37,10.53) 22.19,10.53 U1.35 ; U11.5 v1(23.08,7.47)
  Bottom Layer w0.18: v1(23.08,7.47) 22.22,8.33 22.22,9.72 21.59,10.35 21.55,10.35 v1(21.37,10.53)
SPIHD: length 5.6
  Top Layer w0.18: U1.30 22.21,8.51 26.64,8.51 27,8.14 U11.7
SPIQ: length 9.4
  Top Layer w0.18: v1(26.76,14.16) 27,14.4 U11.2 ; v1(23.05,10.24) 22.92,10.11 U1.34
  Bottom Layer w0.18: v1(26.76,14.16) 24.45,14.16 23.96,13.67 23.96,10.72 23.48,10.24 v1(23.05,10.24)
SPIWP: length 9.6
  Top Layer w0.18: 25.73,15.53 25.73,13.78 25.58,13.63 24.15,13.63 23.79,13.27 23.79,9.29 23.41,8.91 U1.31
USB2_CC1: length 1.8
  Top Layer w0.18: R29.2 6.12,8.17 USB2.B5
USB2_CC2: length 1.8
  Top Layer w0.18: USB2.A5 7.88,11.2 R28.2
XTAL_N: length 17.3
  Top Layer w0.18: U1.53 17.43,14.15 17.43,15.42 18.93,16.92 26.2,16.92 26.71,17.43 26.71,20.02 26.37,20.35 C4.1 25.5,20.32 X1.3
XTAL_P: length 7.7
  Top Layer w0.18: X1.1 21.35,18.65 C3.2 19.03,17.5 17,15.46 U1.54
